# Altium project cyber60-2.PrjPcb
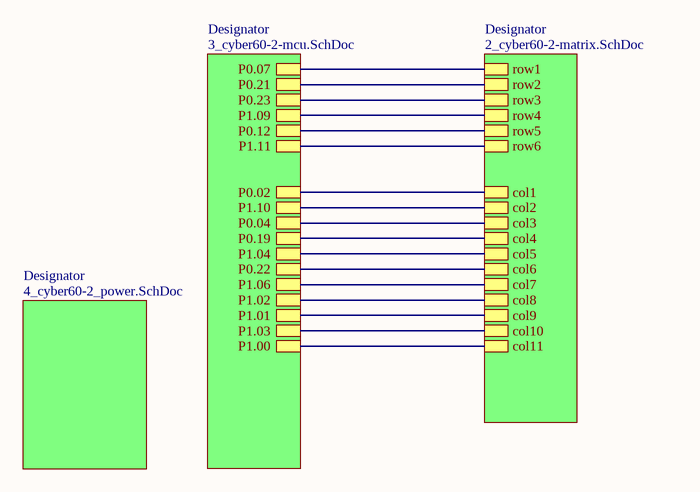
[diagram p0: 1_cyber60-2_top.SchDoc]
4 sheets, 182 parts. Net scope: hierarchical (ports join the sheet entries above them; power ports are global).
Board file: cyber60-2.PcbDoc
Sheets:
  1_cyber60-2_top.SchDoc
    Designator = 3_cyber60-2-mcu.SchDoc
    Designator = 2_cyber60-2-matrix.SchDoc
    Designator = 4_cyber60-2_power.SchDoc

## Sheet 1_cyber60-2_top.SchDoc: waffling60 - PCB
size A4; Engineer: 4pplet; Revision: RevA; ProjectName: waffling60

### Sub-sheets
Designator = 3_cyber60-2-mcu.SchDoc: P1.02, P1.04, P1.06, P0.12, P1.09, P1.11, P0.04, P1.10, P0.07, P0.02, P0.21, P0.23, P1.03, P1.00, P1.01, P0.22, P0.19
Designator = 2_cyber60-2-matrix.SchDoc: col6, col8, col5, col7, col3, col2, col1, col4, col9, row3, row1, row4, row2, row5, col11, col10, row6
Designator = 4_cyber60-2_power.SchDoc: no entries

### Nets
col1: sheet Designator/P0.02, sheet Designator/col1
col2: sheet Designator/P1.10, sheet Designator/col2
col3: sheet Designator/P0.04, sheet Designator/col3
col4: sheet Designator/P0.19, sheet Designator/col4
col5: sheet Designator/P1.04, sheet Designator/col5
col6: sheet Designator/P0.22, sheet Designator/col6
col7: sheet Designator/P1.06, sheet Designator/col7
col8: sheet Designator/P1.02, sheet Designator/col8
col9: sheet Designator/P1.01, sheet Designator/col9
col10: sheet Designator/P1.03, sheet Designator/col10
col11: sheet Designator/P1.00, sheet Designator/col11
P0.07: sheet Designator/P0.07, sheet Designator/row1
P0.12: sheet Designator/P0.12, sheet Designator/row5
P0.21: sheet Designator/P0.21, sheet Designator/row2
P0.23: sheet Designator/P0.23, sheet Designator/row3
P1.09: sheet Designator/P1.09, sheet Designator/row4
P1.11: sheet Designator/P1.11, sheet Designator/row6

## Sheet 3_cyber60-2-mcu.SchDoc
size A4
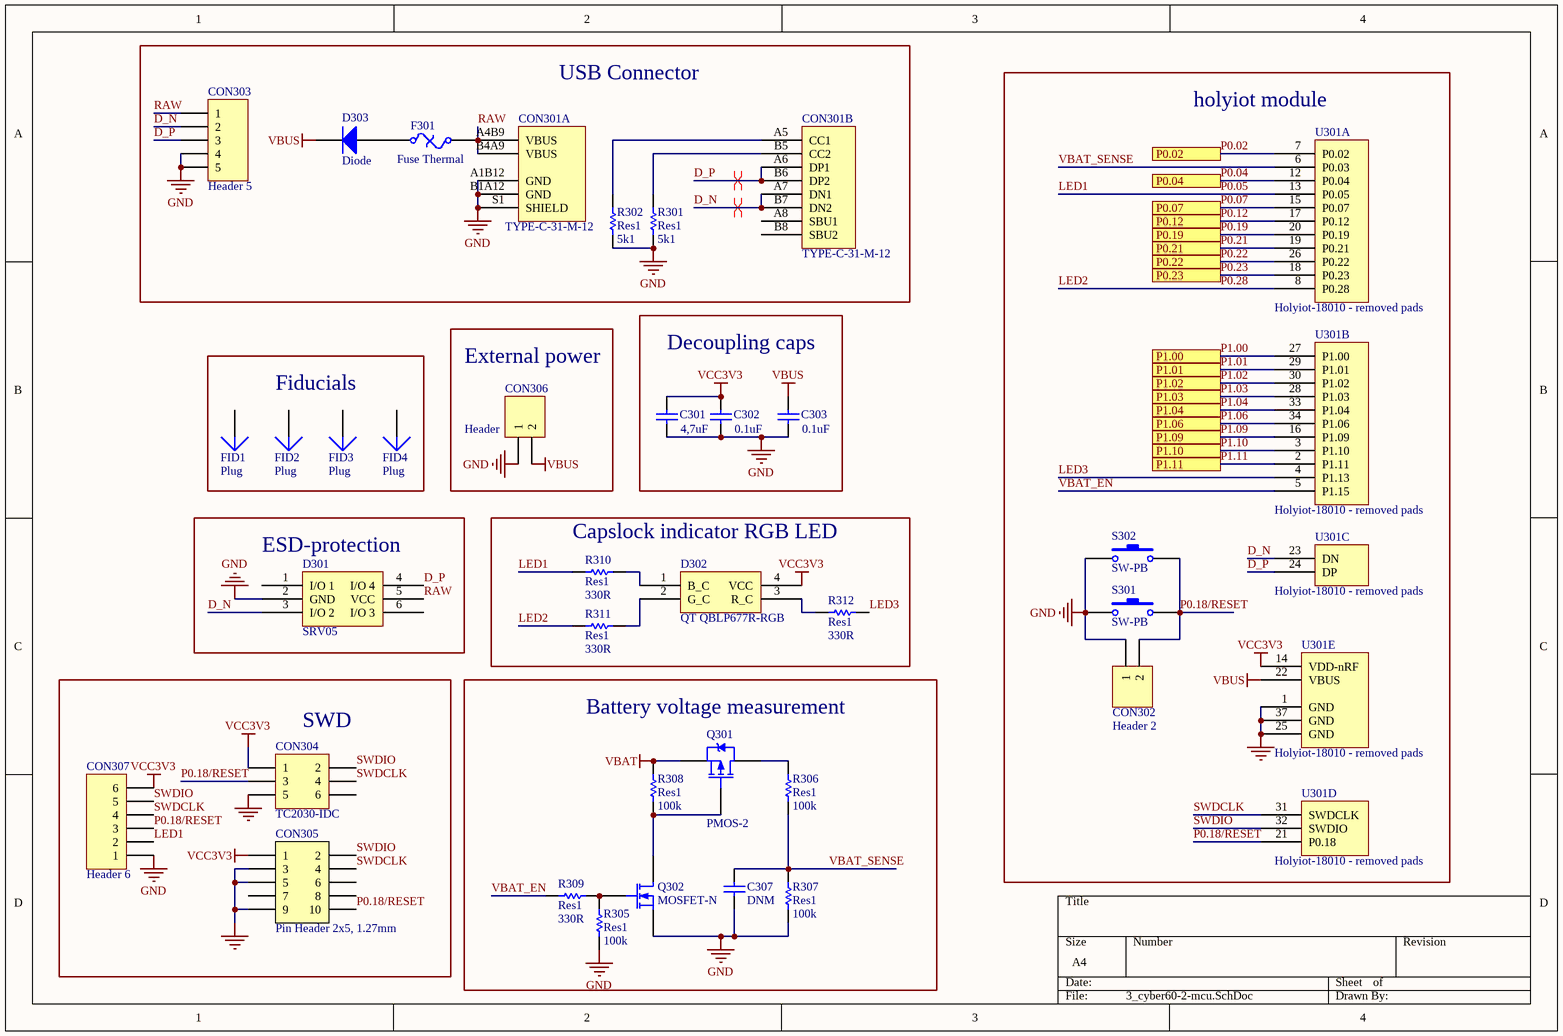
[diagram p1: 3_cyber60-2-mcu.SchDoc]

### Parts
C301  value 4,7uF  [C0603[1608]]
C302  value 0.1uF  [C0603[1608]]
C303  value 0.1uF  [C0603[1608]]
C307  DNM  [C0603[1608]]  (no BOM)
CON301  TYPE-C-31-M-12  [TYPE-C-31-M-12]  (parts A,B of 2)
CON302  Header 2  [HDR1X2]  (no BOM)
CON303  Header 5  [JST SM04B-SRSS-TB]
CON304  TC2030-IDC  [TC2030-IDC-NL]  (no BOM)
CON305  Pin Header 2x5, 1.27mm  [HDR_2x5-SMD-1.27mm-K]  (no BOM)
CON306  Header  [HDR1X2]  (no BOM)
CON307  Header 6  [HDR1X6]  (no BOM)
D301  SRV05  [SOT-23-6]
D302  QT QBLP677R-RGB  [QT QBLP677R-RGB]
D303  Diode  [SOD-123]
F301  Fuse Thermal  [C1206[3216]]
FID1  Plug  [Fiducial_Nordic]  (no BOM)
FID2  Plug  [Fiducial_Nordic]  (no BOM)
FID3  Plug  [Fiducial_Nordic]  (no BOM)
FID4  Plug  [Fiducial_Nordic]  (no BOM)
Q301  PMOS-2  [SOT-23-3]
Q302  MOSFET-N  [SOT-23-3]
R301  Res1  value 5k1  [R0603[1608]]
R302  Res1  value 5k1  [R0603[1608]]
R305  Res1  value 100k  [R0603[1608]]
R306  Res1  value 100k  [R0603[1608]]
R307  Res1  value 100k  [R0603[1608]]
R308  Res1  value 100k  [R0603[1608]]
R309  Res1  value 330R  [R0603[1608]]
R310  Res1  value 330R  [R0603[1608]]
R311  Res1  value 330R  [R0603[1608]]
R312  Res1  value 330R  [R0603[1608]]
S301  SW-PB  [XKB Switch]
S302  SW-PB  [XKB Switch]  (no BOM)
U301  Holyiot-18010 - removed pads  [Holyiot-18010 - removed pads]  (parts A,B,C,D,E of 5)

### Blocks framed on the sheet
USB Connector: CON301 CON303 D303 F301 R301 R302
holyiot module: CON302 S301 S302 U301
External power: CON306
Decoupling caps: C301-C303
Fiducials: FID1-FID4
ESD-protection: D301
Capslock indicator RGB LED: D302 R310-R312
SWD: CON304 CON305 CON307
Battery voltage measurement: C307 Q301 Q302 R305-R309

### Ports
P0.02, P0.04, P0.07, P0.12, P0.19, P0.21, P0.22, P0.23, P1.00, P1.01, P1.02, P1.03, P1.04, P1.06, P1.09, P1.10, P1.11

### Nets
GND: C301.1 C302.1 C303.1 C307.1 CON301.A1B12(GND) CON301.B1A12(GND) CON301.S1(SHIELD) CON302.1 CON303.4 CON303.5 CON304.5 CON305.3 CON305.5 CON305.9 CON306.1 CON307.1 D301.2(GND) Q302.2(S) R301.2 R302.2 R305.2 R307.2 S301.1 S302.2 U301.1(GND) U301.25(GND) U301.37(GND)
VBAT: Q301.2(S) R308.1
VBUS: C303.2 CON306.2 D303.2(K) U301.22(VBUS)
VCC3V3: C301.2 C302.2 CON304.1 CON305.1 CON307.6 D302.4(VCC) U301.14(VDD-nRF)
D_N: CON301.A7(DN1) CON301.B7(DN2) CON303.2 D301.3(I/O_2) U301.23(DN)
D_P: CON301.A6(DP1) CON301.B6(DP2) CON303.3 D301.4(I/O_4) U301.24(DP)
LED1: CON307.2 R310.2 U301.13(P0.05)  [also labelled P0.05]
LED2: R311.2 U301.8(P0.28)  [also labelled P0.28]
LED3: R312.1 U301.4(P1.13)
P0.02: U301.7(P0.02) ; port P0.02  [project net col1]
P0.04: U301.12(P0.04) ; port P0.04  [project net col3]
P0.07: U301.15(P0.07) ; port P0.07
P0.12: U301.17(P0.12) ; port P0.12
P0.18/RESET: CON302.2 CON304.3 CON305.10 CON307.3 S301.2 S302.1 U301.21(P0.18)
P0.19: U301.20(P0.19) ; port P0.19  [project net col4]
P0.21: U301.19(P0.21) ; port P0.21
P0.22: U301.26(P0.22) ; port P0.22  [project net col6]
P0.23: U301.18(P0.23) ; port P0.23
P1.00: U301.27(P1.00) ; port P1.00  [project net col11]
P1.01: U301.29(P1.01) ; port P1.01  [project net col9]
P1.02: U301.30(P1.02) ; port P1.02  [project net col8]
P1.03: U301.28(P1.03) ; port P1.03  [project net col10]
P1.04: U301.33(P1.04) ; port P1.04  [project net col5]
P1.06: U301.34(P1.06) ; port P1.06  [project net col7]
P1.09: U301.16(P1.09) ; port P1.09
P1.10: U301.3(P1.10) ; port P1.10  [project net col2]
P1.11: U301.2(P1.11) ; port P1.11
RAW: CON301.A4B9(VBUS) CON301.B4A9(VBUS) CON303.1 D301.5(VCC) F301.2
SWDCLK: CON304.4 CON305.4 CON307.4 U301.31(SWDCLK)
SWDIO: CON304.2 CON305.2 CON307.5 U301.32(SWDIO)
VBAT_EN: R309.2 U301.5(P1.15)
VBAT_SENSE: C307.2 R306.2 R307.1 U301.6(P0.03)
NetCON301_A5: CON301.A5(CC1) R302.1
NetCON301_B5: CON301.B5(CC2) R301.1
NetD302_1: D302.1(B_C) R310.1
NetD302_2: D302.2(G_C) R311.1
NetD302_3: D302.3(R_C) R312.2
NetD303_1: D303.1(A) F301.1
NetQ301_1: Q301.1(G) Q302.3(D) R308.2
NetQ301_3: Q301.3(D) R306.1
NetQ302_1: Q302.1(G) R305.1 R309.1

Not connected (* = marked no-connect by the designer): CON301 A8(SBU1) B8(SBU2); CON304 6; CON305 6 7 8; D301 1(I/O_1) 6(I/O_3); FID1 1; FID2 1; FID3 1; FID4 1

### Layout directives
differential pair: D_N, D_P

### Library data of the parts
C301 = Cap: Capacitor; MRF.Part: CL10A475KO8NNNC; LCSC MFG: Samsung Electro-Mechanics; LCSC Part #: C19666
C302 C303 = Cap: Capacitor; MRF.Part: CC0603KRX7R9BB104; MFG: KEMET; MFGPN: C0603C104M5RACTU; LCSC MFG: YAGEO; Version: 0603 imperial; LCSC Part #: C14663
C307 = Cap: Capacitor; Version: 0603 imperial
CON301 = TYPE-C-31-M-12: MFG: Korean Hroparts Elec; MFGPN: TYPE-C-31-M-12; LCSC Part #: C165948; LCSC MFG: Korean Hroparts Elec; MRF.Part: TYPE-C-31-M-12
CON302 CON306 = Header 2: Header, 2-Pin
CON303 = Header 5: JST for USB daughter board; MFGPN: SM04B-SRSS-TB(LF)(SN); MFG: JST Sales America Inc.; LCSC MFG: JST Sales America; LCSC Part #: C160404; MRF.Part: SM04B-SRSS-TB(LF)(SN)
CON304 = Header 3X2: Header, 3-Pin, Dual row
CON305 = Pin Header 2x5 SMD, 1.27mm, KS: Pin Header 2x5, 1.27mm (50mil), SMD, Keying Shroud; MFG: Samtec Inc.; MFGPN: FTSH-105-01-F-DV-K-TR; Value: Pin Header 2x5, 1.27mm
CON307 = Header 6: Header, 6-Pin; LatestRevisionDate: 17-Jul-2002; LatestRevisionNote: Re-released for DXP Platform.; Publisher: Altium Limited
D301 = SRV05: MRF.Part: SRV05-4-P-T7; LCSC MFG: ProTek Devices; LCSC Part #: C85364
D302 = QT QBLP677R-RGB: RGB LED; MFG: QT Brightek (QTB); MFGPN: QBLP677R-RGB; Version: Common Anode RGB LED
D303 = Diode: Default Diode; MRF.Part: B5819W; LCSC MFG: Changjiang Electronics Tech (CJ); Version: SOD-123; LCSC Part #: C8598
F301 = Fuse Thermal: Thermal Fuse; MRF.Part: ASMD1206-050; MFG: Bel Fuse Inc.; MFGPN: 0ZCJ0050FF2G; LCSC MFG: Shenzhen JDT Fuse; LCSC Part #: C135338
Q301 = PMOS-2: P-Channel Power MOSFET; MRF.Part: SI2301CDS-T1-GE3; Note: Pin 4 not drawn and electrically connected to Pin 2.; LCSC MFG: Vishay Intertech; LCSC Part #: C10487
Q302 = MOSFET-N: N-Channel MOSFET; MRF.Part: 2N7002; LCSC MFG: Changjiang Electronics Tech (CJ); LCSC Part #: C8545
R301 R302 = Res1: Resistor; MRF.Part: 0603WAF5101T5E; MFG: Panasonic Electronic Components; MFGPN: ERJ-3EKF5101V; LCSC MFG: Uniroyal Elec; Version: 0603 imperial; LCSC Part #: C23186
R305-R308 = Res1: Resistor; MRF.Part: 0603WAF1003T5E; LCSC MFG: Uniroyal Elec; Version: 0603 imperial; LCSC Part #: C25803
R309-R312 = Res1: Resistor; MRF.Part: 0603WAF3300T5E; LCSC MFG: Uniroyal Elec; Version: 0603 imperial; LCSC Part #: C23138
S301 S302 = SW-PB: Switch; MRF.Part: TS-1187A-C-D-B; MFGPN: PTS645SM43SMTR92 LFS; MFG: C&K; LCSC MFG: XKB Enterprise; LCSC Part #: C318888

## Sheet 2_cyber60-2-matrix.SchDoc
size A3
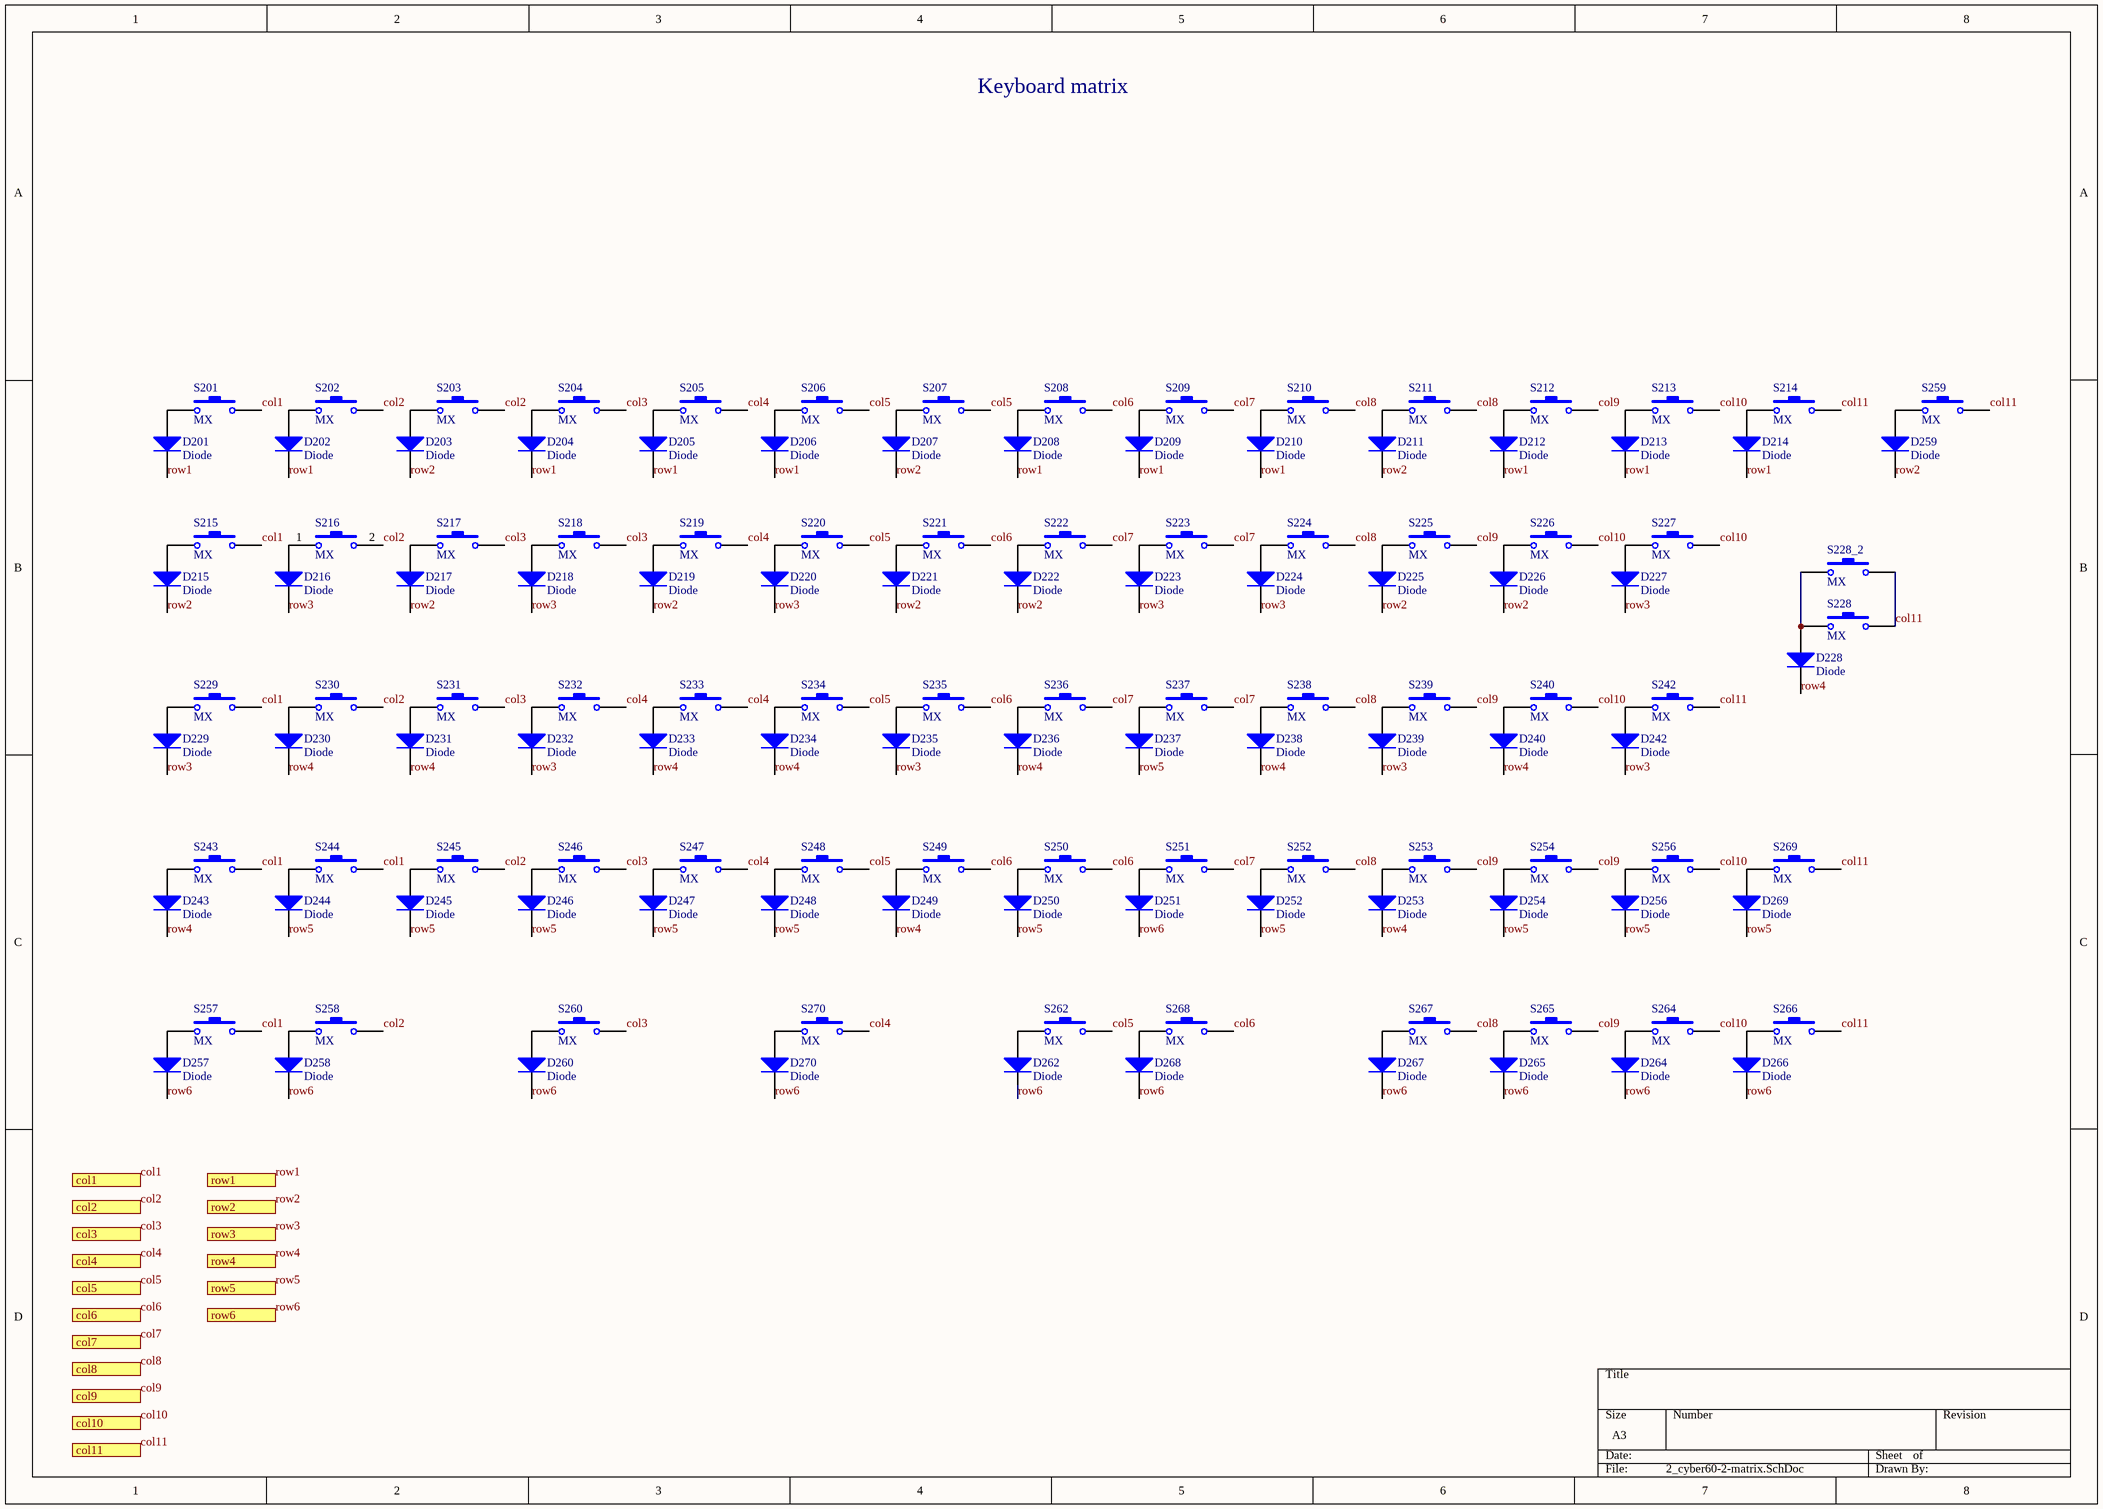
[diagram p2: 2_cyber60-2-matrix.SchDoc]

### Parts
D201  Diode  [SOD-123]
D202  Diode  [SOD-123]
D203  Diode  [SOD-123]
D204  Diode  [SOD-123]
D205  Diode  [SOD-123]
D206  Diode  [SOD-123]
D207  Diode  [SOD-123]
D208  Diode  [SOD-123]
D209  Diode  [SOD-123]
D210  Diode  [SOD-123]
D211  Diode  [SOD-123]
D212  Diode  [SOD-123]
D213  Diode  [SOD-123]
D214  Diode  [SOD-123]
D215  Diode  [SOD-123]
D216  Diode  [SOD-123]
D217  Diode  [SOD-123]
D218  Diode  [SOD-123]
D219  Diode  [SOD-123]
D220  Diode  [SOD-123]
D221  Diode  [SOD-123]
D222  Diode  [SOD-123]
D223  Diode  [SOD-123]
D224  Diode  [SOD-123]
D225  Diode  [SOD-123]
D226  Diode  [SOD-123]
D227  Diode  [SOD-123]
D228  Diode  [SOD-123]
D229  Diode  [SOD-123]
D230  Diode  [SOD-123]
D231  Diode  [SOD-123]
D232  Diode  [SOD-123]
D233  Diode  [SOD-123]
D234  Diode  [SOD-123]
D235  Diode  [SOD-123]
D236  Diode  [SOD-123]
D237  Diode  [SOD-123]
D238  Diode  [SOD-123]
D239  Diode  [SOD-123]
D240  Diode  [SOD-123]
D242  Diode  [SOD-123]
D243  Diode  [SOD-123]
D244  Diode  [SOD-123]
D245  Diode  [SOD-123]
D246  Diode  [SOD-123]
D247  Diode  [SOD-123]
D248  Diode  [SOD-123]
D249  Diode  [SOD-123]
D250  Diode  [SOD-123]
D251  Diode  [SOD-123]
D252  Diode  [SOD-123]
D253  Diode  [SOD-123]
D254  Diode  [SOD-123]
D256  Diode  [SOD-123]
D257  Diode  [SOD-123]
D258  Diode  [SOD-123]
D259  Diode  [SOD-123]
D260  Diode  [SOD-123]
D262  Diode  [SOD-123]
D264  Diode  [SOD-123]
D265  Diode  [SOD-123]
D266  Diode  [SOD-123]
D267  Diode  [SOD-123]
D268  Diode  [SOD-123]
D269  Diode  [SOD-123]
D270  Diode  [SOD-123]
S201  MX  [MX-switch - switched pol]  (no BOM)
S202  MX  [MX-switch - switched pol - connector]  (no BOM)
S203  MX  [MX-switch - switched pol]  (no BOM)
S204  MX  [MX-switch]  (no BOM)
S205  MX  [MX-switch - switched pol]  (no BOM)
S206  MX  [MX-switch - switched pol]  (no BOM)
S207  MX  [MX-switch - switched pol]  (no BOM)
S208  MX  [MX-switch - switched pol]  (no BOM)
S209  MX  [MX-switch - switched pol]  (no BOM)
S210  MX  [MX-switch - switched pol]  (no BOM)
S211  MX  [MX-switch - switched pol]  (no BOM)
S212  MX  [MX-switch - switched pol]  (no BOM)
S213  MX  [MX-switch - switched pol]  (no BOM)
S214  MX  [MX-switch - switched pol]  (no BOM)
S215  MX  [MX-switch - 1.5U - switched pol]  (no BOM)
S216  MX  [MX-switch - switched pol]  (no BOM)
S217  MX  [MX-switch - switched pol]  (no BOM)
S218  MX  [MX-switch - switched pol]  (no BOM)
S219  MX  [MX-switch - switched pol]  (no BOM)
S220  MX  [MX-switch]  (no BOM)
S221  MX  [MX-switch - switched pol]  (no BOM)
S222  MX  [MX-switch - switched pol]  (no BOM)
S223  MX  [MX-switch - switched pol]  (no BOM)
S224  MX  [MX-switch - switched pol]  (no BOM)
S225  MX  [MX-switch - switched pol]  (no BOM)
S226  MX  [MX-switch]  (no BOM)
S227  MX  [MX-switch]  (no BOM)
S228  MX  [MX-switch - 1.5U]  (no BOM)
S228_2  MX  [MX-switch]  (no BOM)
S229  MX  [MX-switch - CAPS]  (no BOM)
S230  MX  [MX-switch - switched pol]  (no BOM)
S231  MX  [MX-switch - switched pol]  (no BOM)
S232  MX  [MX-switch - switched pol]  (no BOM)
S233  MX  [MX-switch - switched pol]  (no BOM)
S234  MX  [MX-switch]  (no BOM)
S235  MX  [MX-switch - switched pol]  (no BOM)
S236  MX  [MX-switch - switched pol]  (no BOM)
S237  MX  [MX-switch - switched pol]  (no BOM)
S238  MX  [MX-switch - switched pol]  (no BOM)
S239  MX  [MX-switch]  (no BOM)
S240  MX  [MX-switch - switched pol]  (no BOM)
S242  MX  [MX-switch - Enter]  (no BOM)
S243  MX  [MX-switch - Left shift]  (no BOM)
S244  MX  [MX-switch - switched pol]  (no BOM)
S245  MX  [MX-switch - switched pol]  (no BOM)
S246  MX  [MX-switch - switched pol]  (no BOM)
S247  MX  [MX-switch - switched pol]  (no BOM)
S248  MX  [MX-switch]  (no BOM)
S249  MX  [MX-switch - switched pol]  (no BOM)
S250  MX  [MX-switch - switched pol]  (no BOM)
S251  MX  [MX-switch - switched pol]  (no BOM)
S252  MX  [MX-switch - switched pol]  (no BOM)
S253  MX  [MX-switch - switched pol]  (no BOM)
S254  MX  [MX-switch - switched pol]  (no BOM)
S256  MX  [MX-switch - right shift]  (no BOM)
S257  MX  [MX-switch - 1.5u MOD-L]  (no BOM)
S258  MX  [MX-switch - 1u MOD-L]  (no BOM)
S259  MX  [MX-switch - backspace]  (no BOM)
S260  MX  [MX-switch - 1.5u MOD-L]  (no BOM)
S262  MX  [MX-switch - Space_V3]  (no BOM)
S264  MX  [MX-switch - 1u MOD-R]  (no BOM)
S265  MX  [MX-switch - 1.5u MOD-R]  (no BOM)
S266  MX  [MX-switch - 1.5u MOD-R]  (no BOM)
S267  MX  [MX-switch - switched pol]  (no BOM)
S268  MX  [MX-switch - R split space_V2]  (no BOM)
S269  MX  [MX-switch]  (no BOM)
S270  MX  [MX-switch - L split space_V2]  (no BOM)

### Ports
col1, col2, col3, col4, col5, col6, col7, col8, col9, col10, col11, row1, row2, row3, row4, row5, row6

### Nets
col1: S201.2 S215.2 S229.2 S243.2 S244.2 S257.2 ; port col1
col2: S202.2 S203.2 S216.2 S230.2 S245.2 S258.2 ; port col2
col3: S204.2 S217.2 S218.2 S231.2 S246.2 S260.2 ; port col3
col4: S205.2 S219.2 S232.2 S233.2 S247.2 S270.2 ; port col4
col5: S206.2 S207.2 S220.2 S234.2 S248.2 S262.1 ; port col5
col6: S208.2 S221.2 S235.2 S249.2 S250.2 S268.2 ; port col6
col7: S209.2 S222.2 S223.2 S236.2 S237.2 S251.2 ; port col7
col8: S210.2 S211.2 S224.2 S238.2 S252.2 S267.2 ; port col8
col9: S212.2 S225.2 S239.2 S253.2 S254.2 S265.1 ; port col9
col10: S213.2 S226.2 S227.2 S240.2 S256.2 S264.2 ; port col10
col11: S214.2 S228.2 S228_2.2 S242.2 S259.2 S266.2 S269.2 ; port col11
row1: D201.2(K) D202.2(K) D204.2(K) D205.2(K) D206.2(K) D208.2(K) D209.2(K) D210.2(K) D212.2(K) D213.2(K) D214.2(K) ; port row1  [project net P0.07]
row2: D203.2(K) D207.2(K) D211.2(K) D215.2(K) D217.2(K) D219.2(K) D221.2(K) D222.2(K) D225.2(K) D226.2(K) D259.2(K) ; port row2  [project net P0.21]
row3: D216.2(K) D218.2(K) D220.2(K) D223.2(K) D224.2(K) D227.2(K) D229.2(K) D232.2(K) D235.2(K) D239.2(K) D242.2(K) ; port row3  [project net P0.23]
row4: D228.2(K) D230.2(K) D231.2(K) D233.2(K) D234.2(K) D236.2(K) D238.2(K) D240.2(K) D243.2(K) D249.2(K) D253.2(K) ; port row4  [project net P1.09]
row5: D237.2(K) D244.2(K) D245.2(K) D246.2(K) D247.2(K) D248.2(K) D250.2(K) D252.2(K) D254.2(K) D256.2(K) D269.2(K) ; port row5  [project net P0.12]
row6: D251.2(K) D257.2(K) D258.2(K) D260.2(K) D262.2(K) D264.2(K) D265.2(K) D266.2(K) D267.2(K) D268.2(K) D270.2(K) ; port row6  [project net P1.11]
NetD201_1: D201.1(A) S201.1
NetD202_1: D202.1(A) S202.1
NetD203_1: D203.1(A) S203.1
NetD204_1: D204.1(A) S204.1
NetD205_1: D205.1(A) S205.1
NetD206_1: D206.1(A) S206.1
NetD207_1: D207.1(A) S207.1
NetD208_1: D208.1(A) S208.1
NetD209_1: D209.1(A) S209.1
NetD210_1: D210.1(A) S210.1
NetD211_1: D211.1(A) S211.1
NetD212_1: D212.1(A) S212.1
NetD213_1: D213.1(A) S213.1
NetD214_1: D214.1(A) S214.1
NetD215_1: D215.1(A) S215.1
NetD216_1: D216.1(A) S216.1
NetD217_1: D217.1(A) S217.1
NetD218_1: D218.1(A) S218.1
NetD219_1: D219.1(A) S219.1
NetD220_1: D220.1(A) S220.1
NetD221_1: D221.1(A) S221.1
NetD222_1: D222.1(A) S222.1
NetD223_1: D223.1(A) S223.1
NetD224_1: D224.1(A) S224.1
NetD225_1: D225.1(A) S225.1
NetD226_1: D226.1(A) S226.1
NetD227_1: D227.1(A) S227.1
NetD228_1: D228.1(A) S228.1 S228_2.1
NetD229_1: D229.1(A) S229.1
NetD230_1: D230.1(A) S230.1
NetD231_1: D231.1(A) S231.1
NetD232_1: D232.1(A) S232.1
NetD233_1: D233.1(A) S233.1
NetD234_1: D234.1(A) S234.1
NetD235_1: D235.1(A) S235.1
NetD236_1: D236.1(A) S236.1
NetD237_1: D237.1(A) S237.1
NetD238_1: D238.1(A) S238.1
NetD239_1: D239.1(A) S239.1
NetD240_1: D240.1(A) S240.1
NetD242_1: D242.1(A) S242.1
NetD243_1: D243.1(A) S243.1
NetD244_1: D244.1(A) S244.1
NetD245_1: D245.1(A) S245.1
NetD246_1: D246.1(A) S246.1
NetD247_1: D247.1(A) S247.1
NetD248_1: D248.1(A) S248.1
NetD249_1: D249.1(A) S249.1
NetD250_1: D250.1(A) S250.1
NetD251_1: D251.1(A) S251.1
NetD252_1: D252.1(A) S252.1
NetD253_1: D253.1(A) S253.1
NetD254_1: D254.1(A) S254.1
NetD256_1: D256.1(A) S256.1
NetD257_1: D257.1(A) S257.1
NetD258_1: D258.1(A) S258.1
NetD259_1: D259.1(A) S259.1
NetD260_1: D260.1(A) S260.1
NetD262_1: D262.1(A) S262.2
NetD264_1: D264.1(A) S264.1
NetD265_1: D265.1(A) S265.2
NetD266_1: D266.1(A) S266.1
NetD267_1: D267.1(A) S267.1
NetD268_1: D268.1(A) S268.1
NetD269_1: D269.1(A) S269.1
NetD270_1: D270.1(A) S270.1

### Notes on the sheet
- Keyboard matrix

### Library data of the parts
D201-D240 D242-D254 D256-D260 D262 D264-D270 = Diode: Default Diode; MRF.Part: 1N4148W; LCSC MFG: ST(Semtech); Version: SOD-123; LCSC Part #: C81598
S201-S214 S216-S228 S228_2 S229-S240 S242-S254 S256-S260 S262 S264-S270 = SW-PB: Switch
S215 = SW-PB: TAB

## Sheet 4_cyber60-2_power.SchDoc: PCA10056 - nRF52840 MCU
size A3; Organization: Nordic Semiconductor; DocumentNumber: 2; SheetNumber: 2; SheetTotal: 7; CompanyName: Nordic Semiconductor; ProjectName: cyber60-2.PrjPcb
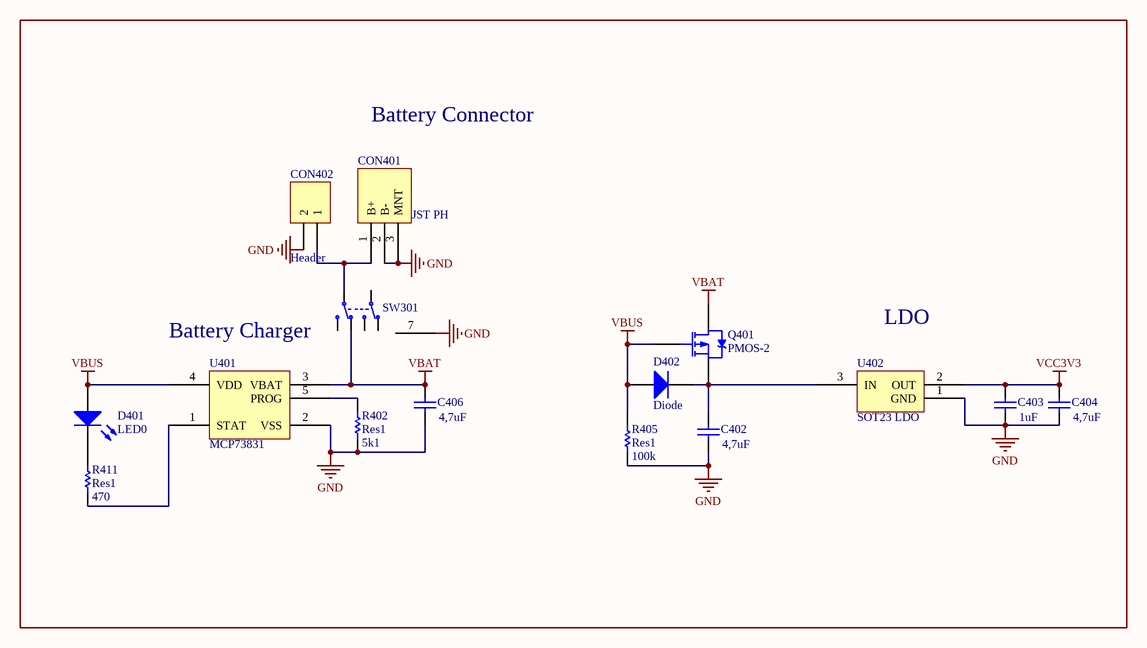
[diagram p3: 4_cyber60-2_power.SchDoc]

### Parts
C402  value 4,7uF  [C0603[1608]]
C403  value 1uF  [C0603[1608]]
C404  value 4,7uF  [C0603[1608]]
C406  value 4,7uF  [C0603[1608]]
CON401  JST PH  [JST SM02B-SRSS-TB]
CON402  Header  [JST S2B-PH-K(LF)(SN)]  (no BOM)
D401  LED0  [LED0603[1608]]
D402  Diode  [SOD-123]
Q401  PMOS-2  [SOT-23-3]
R402  Res1  value 5k1  [R0603[1608]]
R405  Res1  value 100k  [R0603[1608]]
R411  Res1  value 470  [R0603[1608]]
SW301  (no value)  [AlpsAlpine SSSS820201]
U401  MCP73831  [SOT-23-5]
U402  SOT23 LDO  [SOT-23-3]

### Nets
GND: C402.1 C403.1 C404.1 C406.1 CON401.2(B-) CON401.3(MNT) CON402.2 R402.2 R405.2 SW301.7(MNT) U401.2(VSS) U402.1(GND)
VBAT: C406.2 Q401.3(D) SW301.6(N.C-2) U401.3(VBAT)
VBUS: D401.1(A) D402.1(A) Q401.1(G) R405.1 U401.4(VDD)
VCC3V3: C403.2 C404.2 U402.2(OUT)
NetC402_2: C402.2 D402.2(K) Q401.2(S) U402.3(IN)
NetCON401_1: CON401.1(B+) CON402.1 SW301.5(COM-2)
NetD401_2: D401.2(K) R411.2
NetR402_1: R402.1 U401.5(PROG)
NetR411_1: R411.1 U401.1(STAT)

Not connected (* = marked no-connect by the designer): SW301 1(N.O-1) 2(COM-1) 3(N.C-1) 4(N.O-2)

### Notes on the sheet
- Battery Connector
- (near SW301) Battery Charger
- LDO
- Title
- Size:
- Date:
- A3
- Number:
- Time:
- Revision:
- Sheet
- of
- File:

### Library data of the parts
C402 C404 C406 = Cap: as C301 on sheet 3_cyber60-2-mcu; LCSC Part #: C19666
C403 = Cap: Capacitor; MRF.Part: CL10A105KB8NNNC; MFG: KEMET; MFGPN: C0603C104M5RACTU; LCSC MFG: Samsung Electro-Mechanics; Version: 0603 imperial; LCSC Part #: C15849
CON401 = JST S2B-PH-SM4-TB: MRF.Part: SM02B-SRSS-TB(LF)(SN); LCSC MFG: JST Sales America; LCSC Part #: C160402
CON402 = Header 2: Header, 2-Pin; MRF.Part: S2B-PH-K(LF)(SN); LCSC MFG: JST Sales America; LCSC Part #: C265016
D401 = LED0: Typical INFRARED GaAs LED; MRF.Part: 19-213/Y2C-CQ2R2L/3T(CY); LCSC MFG: Everlight Elec; LCSC Part #: C72038
D402 = Diode: as D303 on sheet 3_cyber60-2-mcu; Version: SOD-123; LCSC Part #: C8598
Q401 = PMOS-2: as Q301 on sheet 3_cyber60-2-mcu; LCSC Part #: C10487
R402 = Res1: as R301 on sheet 3_cyber60-2-mcu; Version: 0603 imperial; LCSC Part #: C23186
R405 = Res1: as R305 on sheet 3_cyber60-2-mcu; Version: 0603 imperial; LCSC Part #: C25803
R411 = Res1: Resistor; MRF.Part: 0603WAF4700T5E; MFG: Panasonic Electronic Components; MFGPN: ERJ-3EKF5101V; LCSC MFG: UNI-ROYAL(Uniroyal Elec); Version: 0603 imperial; LCSC Part #: C23179
SW301 = MKH-22D14-G2-B: Slide Switch DPDT; MRF.Part: SSSS820201; LCSC MFG: ALPS Electric; LCSC Part #: C160879
U401 = MCP73831: MRF.Part: TP4054; LCSC MFG: Nanjing Extension Microelectronics; LCSC Part #: C32574
U402 = SOT23 LDO: MRF.Part: XC6206P332MR; LCSC MFG: Torex Semicon; MFG: Texas Instruments; MFGPN: TPS7A0533PDBZ; LCSC Part #: C5446

## Nets that join several sheets
GND: 3_cyber60-2-mcu (27 pins), 4_cyber60-2_power (12 pins)
VBAT: 3_cyber60-2-mcu (Q301.2 R308.1), 4_cyber60-2_power (C406.2 Q401.3 SW301.6 U401.3)
VBUS: 3_cyber60-2-mcu (C303.2 CON306.2 D303.2 U301.22), 4_cyber60-2_power (5 pins)
VCC3V3: 3_cyber60-2-mcu (7 pins), 4_cyber60-2_power (C403.2 C404.2 U402.2)
col1: 3_cyber60-2-mcu (U301.7), 2_cyber60-2-matrix (6 pins)
col2: 3_cyber60-2-mcu (U301.3), 2_cyber60-2-matrix (6 pins)
col3: 3_cyber60-2-mcu (U301.12), 2_cyber60-2-matrix (6 pins)
col4: 3_cyber60-2-mcu (U301.20), 2_cyber60-2-matrix (6 pins)
col5: 3_cyber60-2-mcu (U301.33), 2_cyber60-2-matrix (6 pins)
col6: 3_cyber60-2-mcu (U301.26), 2_cyber60-2-matrix (6 pins)
col7: 3_cyber60-2-mcu (U301.34), 2_cyber60-2-matrix (6 pins)
col8: 3_cyber60-2-mcu (U301.30), 2_cyber60-2-matrix (6 pins)
col9: 3_cyber60-2-mcu (U301.29), 2_cyber60-2-matrix (6 pins)
col10: 3_cyber60-2-mcu (U301.28), 2_cyber60-2-matrix (6 pins)
col11: 3_cyber60-2-mcu (U301.27), 2_cyber60-2-matrix (7 pins)
P0.07: 3_cyber60-2-mcu (U301.15), 2_cyber60-2-matrix (11 pins)
P0.12: 3_cyber60-2-mcu (U301.17), 2_cyber60-2-matrix (11 pins)
P0.21: 3_cyber60-2-mcu (U301.19), 2_cyber60-2-matrix (11 pins)
P0.23: 3_cyber60-2-mcu (U301.18), 2_cyber60-2-matrix (11 pins)
P1.09: 3_cyber60-2-mcu (U301.16), 2_cyber60-2-matrix (11 pins)
P1.11: 3_cyber60-2-mcu (U301.2), 2_cyber60-2-matrix (11 pins)